# EAGLE schematic futurew (EAGLE 9.4.1)
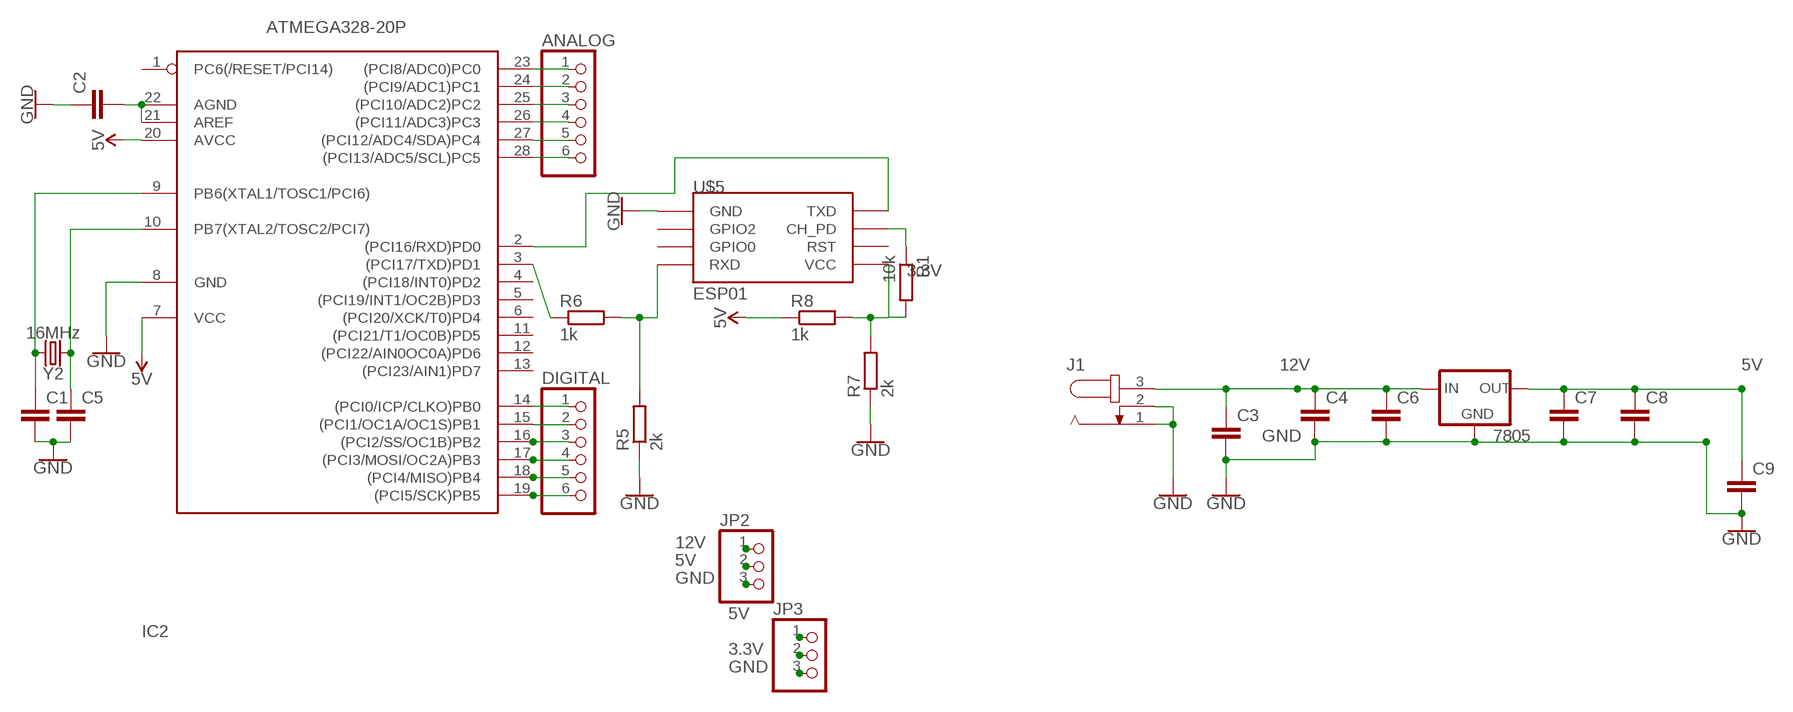
[diagram p0: schematic, sheet 1]

## Parts
7805  78XXL  [78XXL]
ANALOG  PINHD-1X6  [1X06]
C1  C2,5-3  [C2.5-3]
C2  C2,5-3  [C2.5-3]
C3  C2,5-3  [C2.5-3]
C4  C2,5-3  [C2.5-3]
C5  C2,5-3  [C2.5-3]
C6  C2,5-3  [C2.5-3]
C7  C2,5-3  [C2.5-3]
C8  C2,5-3  [C2.5-3]
C9  C2,5-3  [C2.5-3]
DIGITAL  PINHD-1X6  [1X06]
IC2  ATMEGA328-20P  [DIL28-3]
J1  JACK-PLUG1  [SPC4078]
JP2  PINHD-1X3  [1X03]
JP3  PINHD-1X3  [1X03]
R1  10k  R-EU_0204/5  [0204/5]
R5  2k  R-EU_0204/5  [0204/5]
R6  1k  R-EU_0204/5  [0204/5]
R7  2k  R-EU_0204/5  [0204/5]
R8  1k  R-EU_0204/5  [0204/5]
U$5  ESP01  [ESP01]
Y2  16MHz  CRYSTAL-16MHZPTH-HC49US  [HC49US]

## Nets
3.3V: JP3.2 R7.2 R8.2 U$5.VCC
5V: 7805.OUT C7.1 C8.1 C9.1 IC2.7(VCC) IC2.20(AVCC) JP2.2 JP3.1 R8.1
12V: 7805.IN C3.1 C4.1 C6.1 J1.3 JP2.1
GND: 7805.GND C1.2 C2.1 C3.2 C4.2 C5.2 C6.2 C7.2 C8.2 C9.2 IC2.8(GND) J1.1 J1.2 JP2.3 JP3.3 R5.1 R7.1 U$5.GND
N$1: R5.2 R6.2 U$5.RX(RXD)
N$2: IC2.3((PCI17/TXD)PD1) R6.1
N$3: IC2.2((PCI16/RXD)PD0) U$5.TX(TXD)
N$4: DIGITAL.6 IC2.19((PCI5/SCK)PB5)
N$5: DIGITAL.5 IC2.18((PCI4/MISO)PB4)
N$6: DIGITAL.4 IC2.17((PCI3/MOSI/OC2A)PB3)
N$7: DIGITAL.3 IC2.16((PCI2/SS/OC1B)PB2)
N$8: ANALOG.1 IC2.23((PCI8/ADC0)PC0)
N$9: ANALOG.2 IC2.24((PCI9/ADC1)PC1)
N$10: ANALOG.3 IC2.25((PCI10/ADC2)PC2)
N$11: C2.2 IC2.21(AREF) IC2.22(AGND)
N$12: ANALOG.4 IC2.26((PCI11/ADC3)PC3)
N$13: ANALOG.5 IC2.27((PCI12/ADC4/SDA)PC4)
N$14: ANALOG.6 IC2.28((PCI13/ADC5/SCL)PC5)
N$15: DIGITAL.1 IC2.14((PCI0/ICP/CLKO)PB0)
N$16: DIGITAL.2 IC2.15((PCI1/OC1A/OC1S)PB1)
N$17: R1.1 U$5.CH_PD
N$18: R1.2
N$43: C5.1 IC2.10(PB7(XTAL2/TOSC2/PCI7)) Y2.1
N$45: C1.1 IC2.9(PB6(XTAL1/TOSC1/PCI6)) Y2.2
Unconnected: IC2.1(PC6(/RESET/PCI14)) IC2.4((PCI18/INT0)PD2) IC2.5((PCI19/INT1/OC2B)PD3) IC2.6((PCI20/XCK/T0)PD4) IC2.11((PCI21/T1/OC0B)PD5) IC2.12((PCI22/AIN0OC0A)PD6) IC2.13((PCI23/AIN1)PD7) U$5.GPIO0 U$5.GPIO2 U$5.RST

## Library data of the parts
7805 = v-reg:78XXL: VOLTAGE REGULATOR
ANALOG DIGITAL = pinhead:PINHD-1X6: PIN HEADER
C1-C9 = capacitor-wima:C: CAPACITOR naming: grid - package width
IC2 = atmega328:ATMEGA328*P: MICROCONTROLLER 32 kBytes FLASH 2 kBytes SRAM 1 kBytes EEPROM USART 8-channel 10 bit ADC
J1 = con-jack:JACK-PLUG: DC POWER JACK Power Jack, DC, Right Angle, Through Hole, Rated 5A at 16VDC, PC Terminals Distributor: Farnell (www.Farnell.de) Drawing: 84N1161.pdf / 84N1162.pdf Manufacturer: SPC Technology (www.spctechnology.com) Type: SPC4077 / SPC 4078; OC_FARNELL: unknown; OC_NEWARK: unknown
JP2 JP3 = pinhead:PINHD-1X3: PIN HEADER
R1 R5-R8 = resistor:R-EU_: RESISTOR, European symbol
U$5 = esp8266modules:ESP01: ESP8266 Wifi module 01
Y2 = SparkFun-Clocks:CRYSTAL-16MHZ: 16MHz Crystal Digikey Example <http://www.digikey.com/product-search/en?keywords=535-9122-1-ND> Frequency: 16MHz Frequency Stability: ±50ppm Frequency Tolerance: ±20ppm Load Capacitance: 18pF SparkFun Products: Pro Micro -5V/16MHz <https://www.sparkfun.com/products/12640> SparkFun Serial Enabled LCD Kit <https://www.sparkfun.com/products/10097>; PROD_ID: XTAL-08181; SF_ID: COM-00536

## Net classes
0 default: width 1.016 mm, clearance 0.381 mm